# EasyEDA Pro project ProPrj_ProDoc_Board_AI8051U_20240829A_2024-08-30.epro, schematic Schematic_20240829A, sheet 6 of 6

## Sheets
6 P6
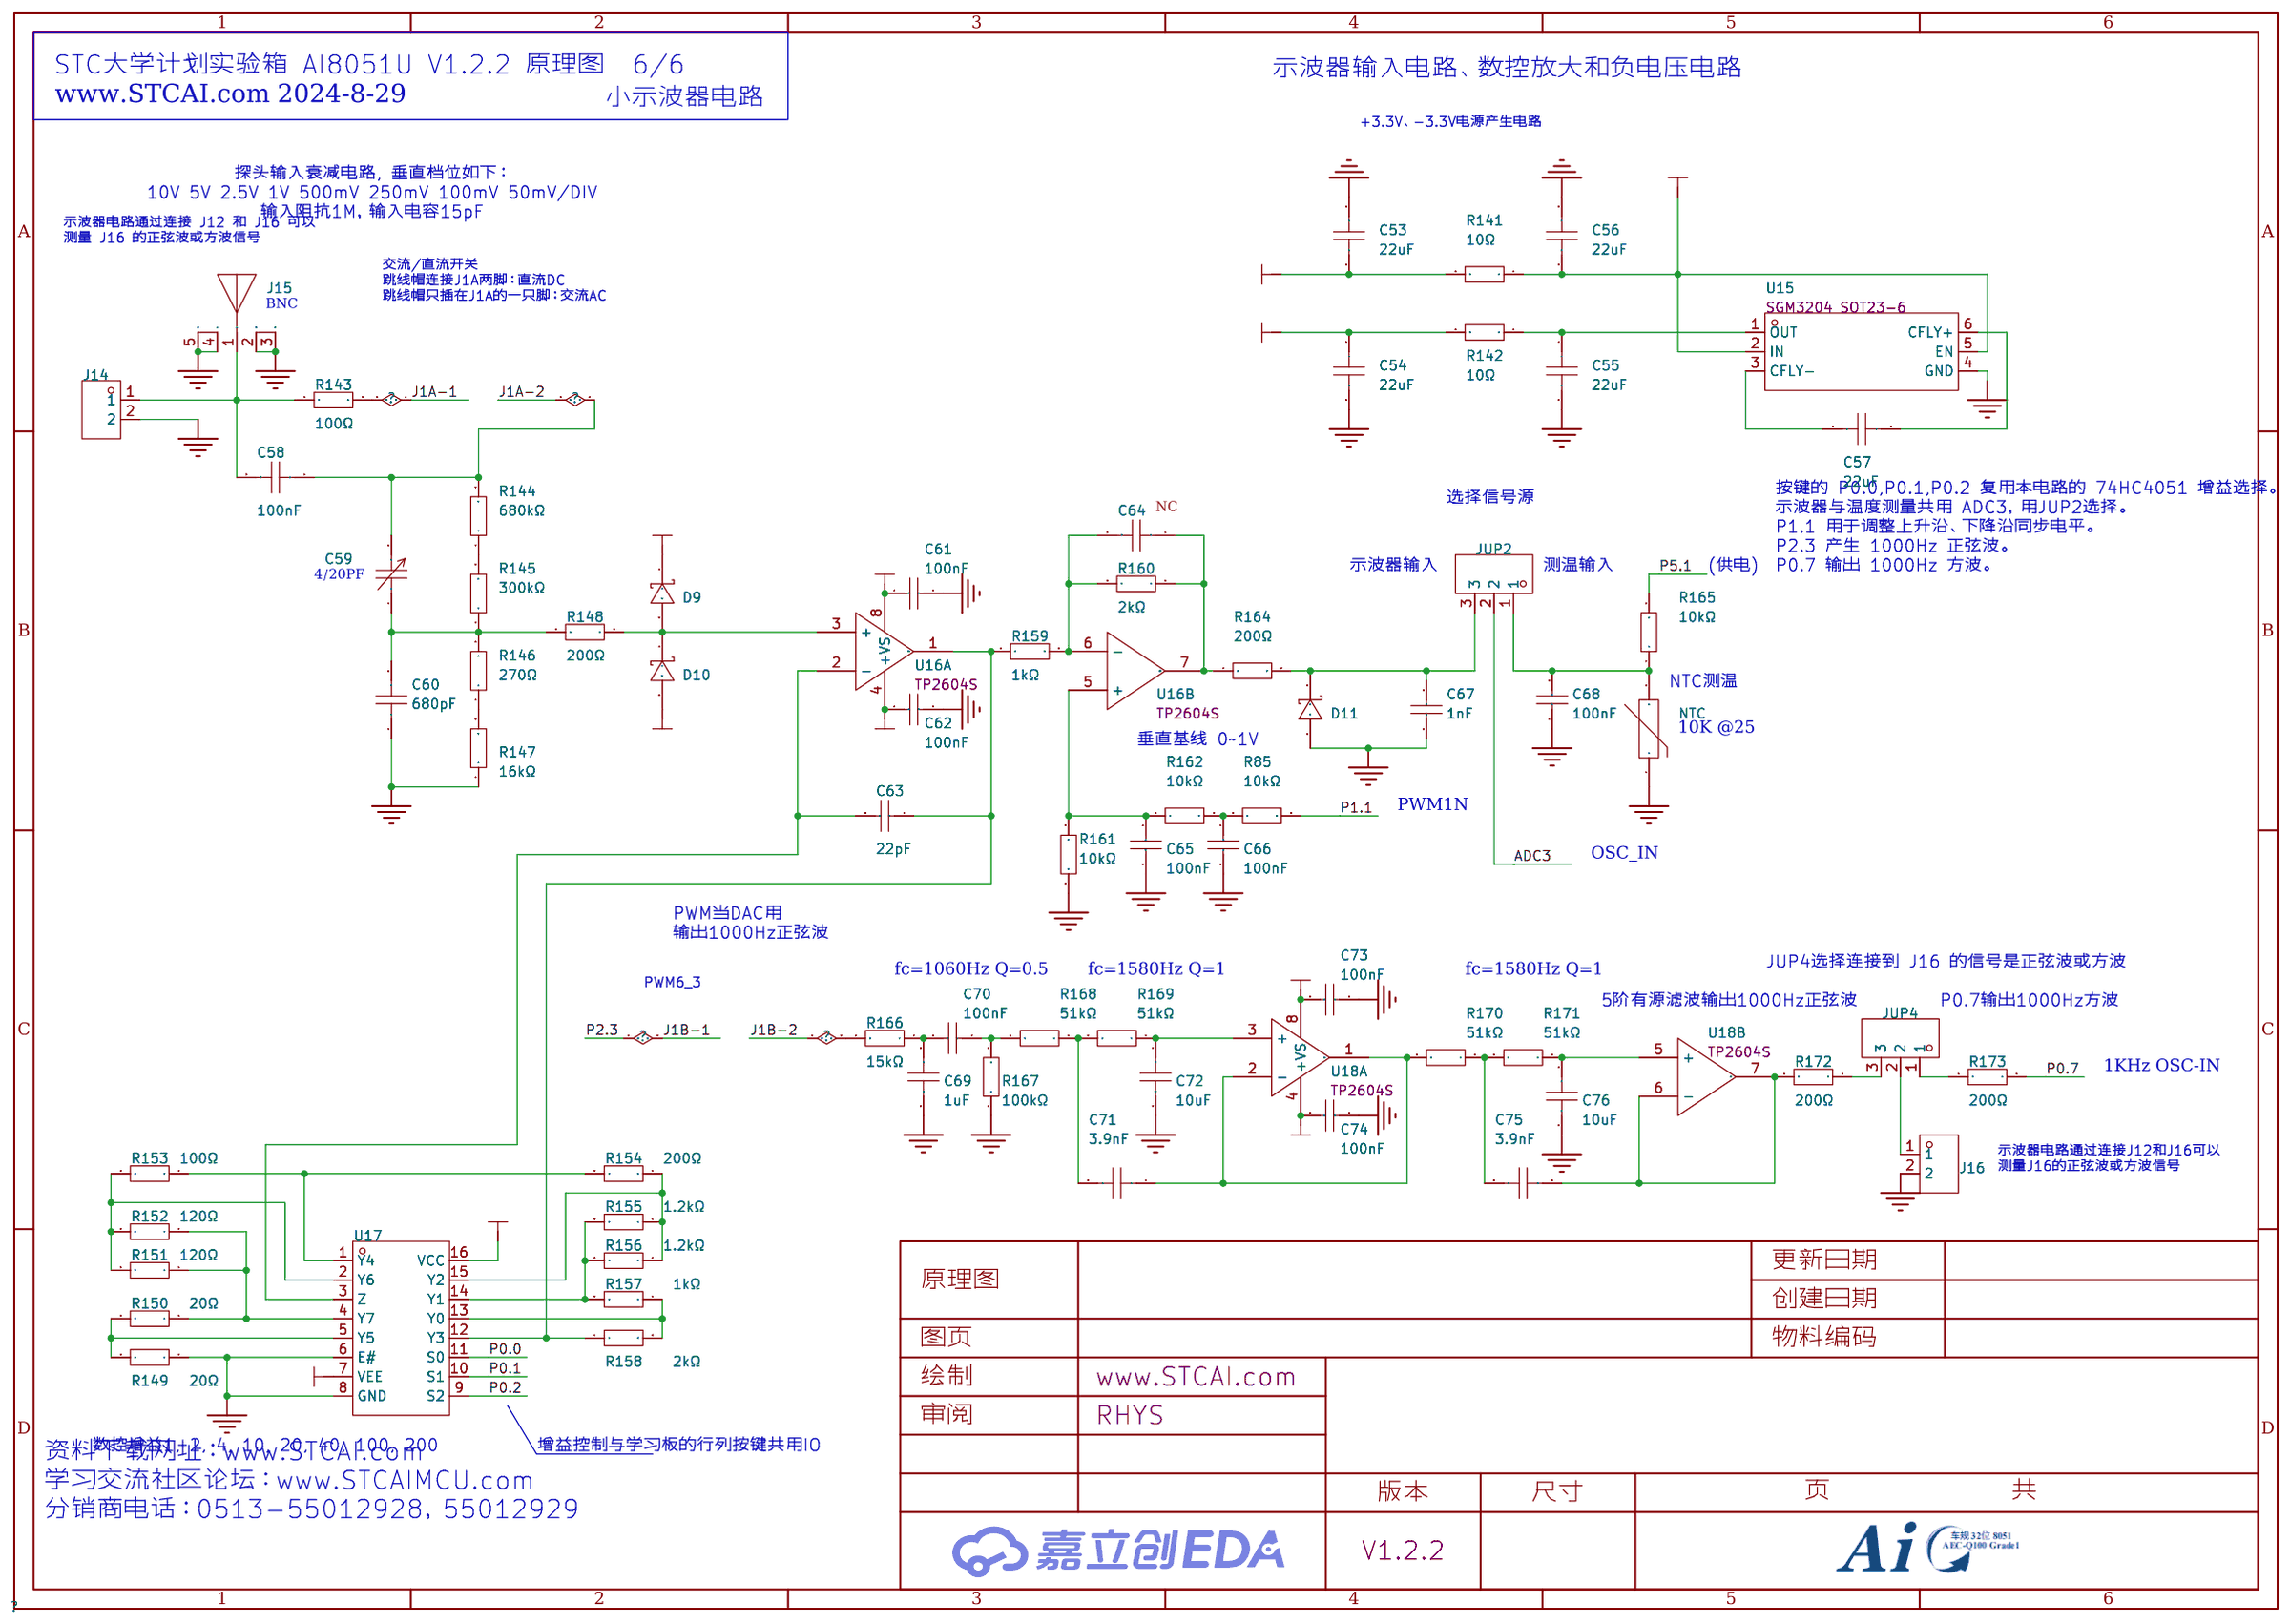
[diagram p5: P6]

## Parts
C53  22uF  [C0603]
C54  22uF  [C0603]
C55  22uF  [C0603]
C56  22uF  [C0603]
C57  22uF  [C0603]
C58  100nF  [C1206]
C59  GKG10015  [CAP-TH_GKGXXX15]
C60  680pF  [C0603]
C61  100nF  [C0603]
C62  100nF  [C0603]
C63  22pF  [C0603]
C64  100nF  [C0603]
C65  100nF  [C0603]
C66  100nF  [C0603]
C67  1nF  [C0603]
C68  100nF  [C0603]
C69  1uF  [C0603]
C70  100nF  [C0603]
C71  3.9nF  [C0603]
C72  10uF  [C0603]
C73  100nF  [C0603]
C74  100nF  [C0603]
C75  3.9nF  [C0603]
C76  10uF  [C0603]
D9  1N5817WS  [SOD-323_L1.8-W1.3-LS2.5-RD]
D10  1N5817WS  [SOD-323_L1.8-W1.3-LS2.5-RD]
D11  1N5817WS  [SOD-323_L1.8-W1.3-LS2.5-RD]
J14  BX-XH2.54-2PZZ  [CONN-TH_2P-P2.50_BX-XH2.54-2PZZ]
J15  DOSIN-801-0078  [ANT-TH_DOSIN-801-0078]
J16  BX-XH2.54-2PZZ  [CONN-TH_2P-P2.50_BX-XH2.54-2PZZ]
JUP2  DZ254S-11-03-48  [HDR-TH_3P-P2.54_DZ254S-11-03-48]
JUP4  DZ254S-11-03-48  [HDR-TH_3P-P2.54_DZ254S-11-03-48]
NTC  SDNT1608X103F3950FTF  [R0603]
R85  10kΩ  [R0603]
R141  10Ω  [R0603]
R142  10Ω  [R0603]
R143  100Ω  [R0603]
R144  680kΩ  [R0603]
R145  300kΩ  [R0603]
R146  270Ω  [R0603]
R147  16kΩ  [R0603]
R148  200Ω  [R0603]
R149  20Ω  [R0603]
R150  20Ω  [R0603]
R151  120Ω  [R0603]
R152  120Ω  [R0603]
R153  100Ω  [R0603]
R154  200Ω  [R0603]
R155  1.2kΩ  [R0603]
R156  1.2kΩ  [R0603]
R157  1kΩ  [R0603]
R158  2kΩ  [R0603]
R159  1kΩ  [R0603]
R160  2kΩ  [R0603]
R161  10kΩ  [R0603]
R162  10kΩ  [R0603]
R164  200Ω  [R0603]
R165  10kΩ  [R0603]
R166  15kΩ  [R0603]
R167  100kΩ  [R0603]
R168  51kΩ  [R0603]
R169  51kΩ  [R0603]
R170  51kΩ  [R0603]
R171  51kΩ  [R0603]
R172  200Ω  [R0603]
R173  200Ω  [R0603]
U15  SGM3204 SOT23-6  [SOT-23-6_L2.9-W1.6-P0.95-LS2.8-BR]
U16  TP2604S  [SOIC-8_L4.9-W3.9-P1.27-LS6.0-BL]  (sections 1,2)
U17  74HC4051  [SOP-16_L9.9-W3.9-P1.27-LS6.0-BL]
U18  TP2604S  [SOIC-8_L4.9-W3.9-P1.27-LS6.0-BL]  (sections 1,2)

## Library data of the parts
C53-C57 = CL10A226MO7JZNC: 容值:22uF;精度:±20%;额定电压:16V;材质(温度系数):X5R;; LCSC Part Name: 22uF ±20% 16V; Supplier Part: C2762594; Manufacturer: SAMSUNG(三星); Supplier Footprint: 0603; JLCPCB Part Class: 扩展库; Datasheet: https://atta.szlcsc.com/upload/public/pdf/source/20220811/0832C3B1C642040B023B7A6186895861.pdf; Supplier: LCSC; Tolerance: ±20%; Voltage Rated: 16V; Temperature Coefficient: X5R
C58 = 1206B104K251NT_C2909525: 容值:100nF;精度:±10%;额定电压:250V;材质(温度系数):X7R;; LCSC Part Name: 100nF ±10% 250V; Supplier Part: C2909525; Manufacturer: FH(风华); Manufacturer Part: 1206B104K251NT; Supplier Footprint: 1206; JLCPCB Part Class: 扩展库; Datasheet: https://atta.szlcsc.com/upload/public/pdf/source/20211026/1B9CC6FF40D574A190437DF0D5F8F6A6.pdf; Supplier: LCSC; Tolerance: ±10%; Voltage Rated: 250V; Temperature Coefficient: X7R
C59 = GKG10015: 静电容量:3pF~10pF;Q值:300@1MHz;; LCSC Part Name: 3pF~10pF; Supplier Part: C7281543; Manufacturer: EW Electronics; Supplier Footprint: 插件; JLCPCB Part Class: 扩展库; Datasheet: https://atta.szlcsc.com/upload/public/pdf/source/231023/GKGxx015_016_Series_DS-90a4209247c940cb70af2bed7fe9267d.pdf; Supplier: LCSC; electrostatic capacity: 3pF~10pF; Q @ Freq: 300@1MHz; Operating Temperature: -25℃~+85℃; Body Height: 5mm
C60 = CL10C681JB81PNC: 容值:680pF;精度:±5%;额定电压:50V;材质(温度系数):C0G;; LCSC Part Name: 680pF ±5% 50V; Supplier Part: C472800; Manufacturer: SAMSUNG(三星); Supplier Footprint: 0603; JLCPCB Part Class: 扩展库; Datasheet: https://atta.szlcsc.com/upload/public/pdf/source/20160218/1457707763339.pdf; Supplier: LCSC; Tolerance: ±5%; Voltage Rated: 50V; Temperature Coefficient: C0G
C61 C62 C65 C66 C68 C70 C73 C74 = CL10B104KO8NNNC: 容值:100nF;精度:±10%;额定电压:16V;材质(温度系数):X7R;; LCSC Part Name: 100nF ±10% 16V; Supplier Part: C66501; Manufacturer: SAMSUNG(三星); Supplier Footprint: 0603; JLCPCB Part Class: 扩展库; Datasheet: https://atta.szlcsc.com/upload/public/pdf/source/20160218/1457707763339.pdf; Supplier: LCSC; Tolerance: ±10%; Voltage Rated: 16V; Temperature Coefficient: X7R
C63 = CL10C220JB8NNNC: 容值:22pF;精度:±5%;额定电压:50V;材质(温度系数):C0G;; LCSC Part Name: 22pF ±5% 50V; Supplier Part: C1653; Manufacturer: SAMSUNG(三星); Supplier Footprint: 0603; Datasheet: https://atta.szlcsc.com/upload/public/pdf/source/20160218/1457707763339.pdf; Supplier: LCSC; Tolerance: ±5%; Voltage Rated: 50V; Temperature Coefficient: C0G
C64 = CC0603KRX7R9BB104: 容值:100nF;精度:±10%;额定电压:50V;材质(温度系数):X7R;; LCSC Part Name: 100nF ±10% 50V; Supplier Part: C14663; Manufacturer: YAGEO(国巨); Supplier Footprint: 0603; JLCPCB Part Class: 基础库; Datasheet: https://atta.szlcsc.com/upload/public/pdf/source/20180910/C282072_33301C7F631E79921B82A8DAC6BCC5B3.pdf; Supplier: LCSC; Tolerance: ±10%; Voltage Rated: 50V; Temperature Coefficient: X7R
C67 = CL10B102KB8NNNC: 容值:1nF;精度:±10%;额定电压:50V;材质(温度系数):X7R;; LCSC Part Name: 1nF ±10% 50V; Supplier Part: C1588; Manufacturer: SAMSUNG(三星); Supplier Footprint: 0603; JLCPCB Part Class: 基础库; Datasheet: https://atta.szlcsc.com/upload/public/pdf/source/20160218/1457707763339.pdf; Supplier: LCSC; Tolerance: ±10%; Voltage Rated: 50V; Temperature Coefficient: X7R
C69 = CL10A105KB8NNNC: 容值:1uF;精度:±10%;额定电压:50V;材质(温度系数):X5R;; LCSC Part Name: 1uF ±10% 50V; Supplier Part: C15849; Manufacturer: SAMSUNG(三星); Supplier Footprint: 0603; Datasheet: https://atta.szlcsc.com/upload/public/pdf/source/20160218/1457707763339.pdf; Supplier: LCSC; Tolerance: ±10%; Voltage Rated: 50V; Temperature Coefficient: X5R
C71 C75 = TCC0603X7R392K500CT: 容值:3.9nF;精度:±10%;额定电压:50V;材质(温度系数):X7R;; LCSC Part Name: 3.9nF ±10% 50V; Supplier Part: C376832; Manufacturer: CCTC(三环); Supplier Footprint: 0603; JLCPCB Part Class: 扩展库; Datasheet: https://atta.szlcsc.com/upload/public/pdf/source/20191203/C466239_F62A586702D44EEA1C39B32FC8662B21.pdf; Supplier: LCSC; Tolerance: ±10%; Voltage Rated: 50V; Temperature Coefficient: X7R
C72 C76 = CL10A106KP8NNNC: 容值:10uF;精度:±10%;额定电压:10V;材质(温度系数):X5R;; LCSC Part Name: 10uF ±10% 10V; Supplier Part: C19702; Manufacturer: SAMSUNG(三星); Supplier Footprint: 0603; Datasheet: https://atta.szlcsc.com/upload/public/pdf/source/20160218/1457707763339.pdf; Supplier: LCSC; Tolerance: ±10%; Voltage Rated: 10V; Temperature Coefficient: X5R
D9-D11 = 1N5817WS: 正向压降(Vf):750mV@3.1A;直流反向耐压(Vr):20V;平均整流电流(Io):1A;; LCSC Part Name: 电压:20V 电流:1A; Supplier Part: C489146; Manufacturer: KEXIN(科信); Supplier Footprint: SOD-323; JLCPCB Part Class: 扩展库; Datasheet: https://atta.szlcsc.com/upload/public/pdf/source/20200225/C489147_F0861A42A5EB259406EDAA7C68BCB597.pdf; Supplier: LCSC; Forward Voltage (Vf@If): 750mV@3.1A; Reverse Voltage (Vr): 20V; Average Rectified Current (Io): 1A
J14 J16 = BX-XH2.54-2PZZ: 插针结构:1x2P;间距:2.54mm;安装方式:直插;参考系列:XH;总PIN数:2P;排数:1;每排PIN数:2;行距:-;额定电流:3A;触头材质:黄铜;触头镀层:锡;工作温度范围:-25℃~+85℃;; Supplier Part: C18077833; Manufacturer: Bossie(博锡); Supplier Footprint: 插件,P=2.54mm; Datasheet: https://atta.szlcsc.com/upload/public/pdf/source/20231017/CB25E46A13930659CD6CDE2F2553A508.pdf; Supplier: LCSC; Pins Structure: 1x2P; Pitch: 2.54mm; Mounting Style: 直插; Reference Series: XH; Number of Pins: 2P; Number of Rows: 1; Number of PINs Per Row: 2; Current Rating (Max): 3A; Contact Material: 黄铜; Contact Plating: 锡; Operating Temperature Range: -25℃~+85℃
J15 = DOSIN-801-0078_C709676: 连接器类型:板端;接口类型:-;端口数量:1;接口直径:9.6mm;接口长度/高度:-;频率-最大值:3GHz;射频系列:BNC;阻抗:50Ω;样式:弯头;工作温度范围:-65℃~+165℃;; LCSC Part Name: BNC 弯头 三件套; Supplier Part: C709676; Manufacturer: dosinconn(德索五金); Supplier Footprint: 插件; JLCPCB Part Class: 扩展库; Datasheet: https://atta.szlcsc.com/upload/public/pdf/source/20200723/C709676_0A7EBCBF50F68B99E2BE199A434018D0.pdf; Supplier: LCSC; Connector Type: 板端; Number of Ports: 1; Interface Diameter: 9.6mm; Frequency-Max: 3GHz; RF Series: BNC; Impedance: 50Ω; Style: 弯头; Operating Temperature Range: -65℃~+165℃
JUP2 JUP4 = DZ254S-11-03-48: 插针结构:1x3P;间距:2.54mm;圆针/方针:方针;安装类型:立贴;排数:单排;总PIN位数:3P;; LCSC Part Name: 间距:2.54mm 1x3P 立贴 方针; Supplier Part: C5160786; Manufacturer: DEALON(德艺隆); Supplier Footprint: SMD,P=2.54mm(交错脚); JLCPCB Part Class: 扩展库; Datasheet: https://atta.szlcsc.com/upload/public/pdf/source/20230921/FE4E6D7F32A2CD9B95B1709A1ADE25FC.pdf; Supplier: LCSC; Pin Structure: 1x3P; Pitch: 2.54mm; Circluar Pins/Square Pins: 方针; Mounting Type: 立贴; Number of Rows: 单排; Number of Pins: 3P
NTC = SDNT1608X103F3950FTF: 阻值(25℃):10kΩ;B值(25℃/50℃):3950K;电阻精度:±1%;功率:100mW;B值精度:±1%;最大稳态电流(25℃):330uA;; LCSC Part Name: 10kΩ 电阻精度:±1% 3950K; Supplier Part: C279936; Manufacturer: Sunlord(顺络); Supplier Footprint: 0603; JLCPCB Part Class: 扩展库; Datasheet: https://atta.szlcsc.com/upload/public/pdf/source/20210916/BF106A3565EDFEB141CB3E0EA3A661F8.pdf; Supplier: LCSC; Resistance @ 25℃: 10kΩ; B Constant (25℃/50℃): 3950K; Resistance Tolerance: ±1%; Power: 100mW; B Constant Tolerance: ±1%; Steady State Current (Max): 330uA; Operating Temperature: -55℃~+125℃
R85 R161 R162 = 0603WAF1002T5E: 电阻类型:厚膜电阻;阻值:10kΩ;精度:±1%;功率:100mW;最大工作电压:75V;温度系数:±100ppm/℃;; LCSC Part Name: 厚膜电阻 10kΩ ±1% 100mW; Supplier Part: C25804; Manufacturer: UNI-ROYAL(厚声); Supplier Footprint: 0603; JLCPCB Part Class: 基础库; Datasheet: https://atta.szlcsc.com/upload/public/pdf/source/20200306/C422600_1E6D84923E4A46A82E41ADD87F860B5C.pdf; Supplier: LCSC; Type: 厚膜电阻; Tolerance: ±1%; Power(Watts): 100mW; Overload Voltage (Max): 75V; Temperature Coefficient: ±100ppm/℃; Operating Temperature Range: -55℃~+155℃
R141 R142 = 0603WAF100JT5E: 电阻类型:厚膜电阻;阻值:10Ω;精度:±1%;功率:100mW;最大工作电压:75V;温度系数:±400ppm/℃;; LCSC Part Name: 10Ω ±1% 100mW 厚膜电阻; Supplier Part: C22859; Manufacturer: UNI-ROYAL(厚声); Supplier Footprint: 0603; Datasheet: https://atta.szlcsc.com/upload/public/pdf/source/20200306/C422600_1E6D84923E4A46A82E41ADD87F860B5C.pdf; Supplier: LCSC; Type: 厚膜电阻; Tolerance: ±1%; Power(Watts): 100mW; Overload Voltage (Max): 75V; Temperature Coefficient: ±400ppm/℃; Operating Temperature Range: -55℃~+155℃
R143 R153 = 0603WAF1000T5E: 电阻类型:厚膜电阻;阻值:100Ω;精度:±1%;功率:100mW;最大工作电压:75V;温度系数:±200ppm/℃;; LCSC Part Name: 100Ω ±1% 100mW 厚膜电阻; Supplier Part: C22775; Manufacturer: UNI-ROYAL(厚声); Supplier Footprint: 0603; JLCPCB Part Class: 基础库; Datasheet: https://atta.szlcsc.com/upload/public/pdf/source/20200306/C422600_1E6D84923E4A46A82E41ADD87F860B5C.pdf; Supplier: LCSC; Type: 厚膜电阻; Tolerance: ±1%; Power(Watts): 100mW; Overload Voltage (Max): 75V; Temperature Coefficient: ±200ppm/℃; Operating Temperature Range: -55℃~+155℃
R144 = RC0603JR-07680KL: 电阻类型:厚膜电阻;阻值:680kΩ;精度:±5%;功率:100mW;最大工作电压:75V;温度系数:±100ppm/℃;; LCSC Part Name: 厚膜电阻 680kΩ ±5% 100mW; Supplier Part: C141272; Manufacturer: YAGEO(国巨); Supplier Footprint: 0603; JLCPCB Part Class: 扩展库; Datasheet: https://atta.szlcsc.com/upload/public/pdf/source/20180821/C275644_0D56F95EFF785E7D9A1FEF436B37DA78.pdf; Supplier: LCSC; Type: 厚膜电阻; Tolerance: ±5%; Power(Watts): 100mW; Overload Voltage (Max): 75V; Temperature Coefficient: ±100ppm/℃; Operating Temperature Range: -55℃~+155℃
R145 = 0603WAF3003T5E: 电阻类型:厚膜电阻;阻值:300kΩ;精度:±1%;功率:100mW;最大工作电压:75V;温度系数:±100ppm/℃;; LCSC Part Name: 300kΩ ±1% 100mW 厚膜电阻; Supplier Part: C23024; Manufacturer: UNI-ROYAL(厚声); Supplier Footprint: 0603; Datasheet: https://atta.szlcsc.com/upload/public/pdf/source/20200306/C422600_1E6D84923E4A46A82E41ADD87F860B5C.pdf; Supplier: LCSC; Type: 厚膜电阻; Tolerance: ±1%; Power(Watts): 100mW; Overload Voltage (Max): 75V; Temperature Coefficient: ±100ppm/℃; Operating Temperature Range: -55℃~+155℃
R146 = 0603WAF2700T5E: 电阻类型:厚膜电阻;阻值:270Ω;精度:±1%;功率:100mW;最大工作电压:75V;温度系数:±100ppm/℃;; LCSC Part Name: 270Ω ±1% 100mW 厚膜电阻; Supplier Part: C22966; Manufacturer: UNI-ROYAL(厚声); Supplier Footprint: 0603; Datasheet: https://atta.szlcsc.com/upload/public/pdf/source/20200306/C422600_1E6D84923E4A46A82E41ADD87F860B5C.pdf; Supplier: LCSC; Type: 厚膜电阻; Tolerance: ±1%; Power(Watts): 100mW; Overload Voltage (Max): 75V; Temperature Coefficient: ±100ppm/℃; Operating Temperature Range: -55℃~+155℃
R147 = AC0603FR-0716KL: 电阻类型:厚膜电阻;阻值:16kΩ;精度:±1%;功率:100mW;最大工作电压:75V;温度系数:±100ppm/℃;; LCSC Part Name: 厚膜电阻 16kΩ ±1% 100mW; Supplier Part: C144696; Manufacturer: YAGEO(国巨); Supplier Footprint: 0603; JLCPCB Part Class: 扩展库; Datasheet: https://atta.szlcsc.com/upload/public/pdf/source/20180927/C229861_4ABDC471507C1ED6AFB4BA66AFC8620A.pdf; Supplier: LCSC; Type: 厚膜电阻; Tolerance: ±1%; Power(Watts): 100mW; Overload Voltage (Max): 75V; Temperature Coefficient: ±100ppm/℃; Operating Temperature Range: -55℃~+155℃
R148 R154 R164 R172 R173 = 0603WAF2000T5E: 电阻类型:厚膜电阻;阻值:200Ω;精度:±1%;功率:100mW;最大工作电压:75V;温度系数:±100ppm/℃;; LCSC Part Name: 200Ω ±1% 100mW 厚膜电阻; Supplier Part: C8218; Manufacturer: UNI-ROYAL(厚声); Supplier Footprint: 0603; JLCPCB Part Class: 基础库; Datasheet: https://atta.szlcsc.com/upload/public/pdf/source/20200306/C422600_1E6D84923E4A46A82E41ADD87F860B5C.pdf; Supplier: LCSC; Type: 厚膜电阻; Tolerance: ±1%; Power(Watts): 100mW; Overload Voltage (Max): 75V; Temperature Coefficient: ±100ppm/℃; Operating Temperature Range: -55℃~+155℃
R149 R150 = 0603WAF200JT5E: 电阻类型:厚膜电阻;阻值:20Ω;精度:±1%;功率:100mW;最大工作电压:75V;温度系数:±100ppm/℃;; LCSC Part Name: 20Ω ±1% 100mW 厚膜电阻; Supplier Part: C22950; Manufacturer: UNI-ROYAL(厚声); Supplier Footprint: 0603; Datasheet: https://atta.szlcsc.com/upload/public/pdf/source/20200306/C422600_1E6D84923E4A46A82E41ADD87F860B5C.pdf; Supplier: LCSC; Type: 厚膜电阻; Tolerance: ±1%; Power(Watts): 100mW; Overload Voltage (Max): 75V; Temperature Coefficient: ±100ppm/℃; Operating Temperature Range: -55℃~+155℃
R151 R152 = 0603WAF1200T5E: 电阻类型:厚膜电阻;阻值:120Ω;精度:±1%;功率:100mW;最大工作电压:75V;温度系数:±100ppm/℃;; LCSC Part Name: 120Ω ±1% 100mW 厚膜电阻; Supplier Part: C22787; Manufacturer: UNI-ROYAL(厚声); Supplier Footprint: 0603; Datasheet: https://atta.szlcsc.com/upload/public/pdf/source/20200306/C422600_1E6D84923E4A46A82E41ADD87F860B5C.pdf; Supplier: LCSC; Type: 厚膜电阻; Tolerance: ±1%; Power(Watts): 100mW; Overload Voltage (Max): 75V; Temperature Coefficient: ±100ppm/℃; Operating Temperature Range: -55℃~+155℃
R155 R156 = 0603WAF1201T5E: 电阻类型:厚膜电阻;阻值:1.2kΩ;精度:±1%;功率:100mW;最大工作电压:75V;温度系数:±100ppm/℃;; LCSC Part Name: 1.2kΩ ±1% 100mW 厚膜电阻; Supplier Part: C22765; Manufacturer: UNI-ROYAL(厚声); Supplier Footprint: 0603; Datasheet: https://atta.szlcsc.com/upload/public/pdf/source/20200306/C422600_1E6D84923E4A46A82E41ADD87F860B5C.pdf; Supplier: LCSC; Type: 厚膜电阻; Tolerance: ±1%; Power(Watts): 100mW; Overload Voltage (Max): 75V; Temperature Coefficient: ±100ppm/℃; Operating Temperature Range: -55℃~+155℃
R157 R159 = 0603WAF1001T5E: 电阻类型:厚膜电阻;阻值:1kΩ;精度:±1%;功率:100mW;最大工作电压:75V;温度系数:±100ppm/℃;; LCSC Part Name: 1kΩ ±1% 100mW 厚膜电阻; Supplier Part: C21190; Manufacturer: UNI-ROYAL(厚声); Supplier Footprint: 0603; JLCPCB Part Class: 基础库; Datasheet: https://atta.szlcsc.com/upload/public/pdf/source/20200306/C422600_1E6D84923E4A46A82E41ADD87F860B5C.pdf; Supplier: LCSC; Type: 厚膜电阻; Tolerance: ±1%; Power(Watts): 100mW; Overload Voltage (Max): 75V; Temperature Coefficient: ±100ppm/℃; Operating Temperature Range: -55℃~+155℃
R158 R160 = 0603WAF2001T5E: 电阻类型:厚膜电阻;阻值:2kΩ;精度:±1%;功率:100mW;最大工作电压:75V;温度系数:±100ppm/℃;; LCSC Part Name: 2kΩ ±1% 100mW 厚膜电阻; Supplier Part: C22975; Manufacturer: UNI-ROYAL(厚声); Supplier Footprint: 0603; JLCPCB Part Class: 基础库; Datasheet: https://atta.szlcsc.com/upload/public/pdf/source/20200306/C422600_1E6D84923E4A46A82E41ADD87F860B5C.pdf; Supplier: LCSC; Type: 厚膜电阻; Tolerance: ±1%; Power(Watts): 100mW; Overload Voltage (Max): 75V; Temperature Coefficient: ±100ppm/℃; Operating Temperature Range: -55℃~+155℃
R165 = ARG03BTC1002: 电阻类型:薄膜电阻;阻值:10kΩ;精度:±0.1%;功率:100mW;最大工作电压:75V;温度系数:±25ppm/℃;; LCSC Part Name: 薄膜电阻 10kΩ ±0.1% 100mW; Supplier Part: C309083; Manufacturer: Viking(光颉); Supplier Footprint: 0603; JLCPCB Part Class: 扩展库; Datasheet: https://atta.szlcsc.com/upload/public/pdf/source/20190816/C412422_E173BA386C6DD8245B6A88358EF9877A.pdf; Supplier: LCSC; Type: 薄膜电阻; Tolerance: ±0.1%; Power(Watts): 100mW; Overload Voltage (Max): 75V; Temperature Coefficient: ±25ppm/℃; Operating Temperature Range: -55℃~+155℃
R166 = 0603WAF1502T5E: 电阻类型:厚膜电阻;阻值:15kΩ;精度:±1%;功率:100mW;最大工作电压:75V;温度系数:±100ppm/℃;; LCSC Part Name: 15kΩ ±1% 100mW 厚膜电阻; Supplier Part: C22809; Manufacturer: UNI-ROYAL(厚声); Supplier Footprint: 0603; JLCPCB Part Class: 基础库; Datasheet: https://atta.szlcsc.com/upload/public/pdf/source/20200306/C422600_1E6D84923E4A46A82E41ADD87F860B5C.pdf; Supplier: LCSC; Type: 厚膜电阻; Tolerance: ±1%; Power(Watts): 100mW; Overload Voltage (Max): 75V; Temperature Coefficient: ±100ppm/℃; Operating Temperature Range: -55℃~+155℃
R167 = 0603WAF1003T5E: 电阻类型:厚膜电阻;阻值:100kΩ;精度:±1%;功率:100mW;最大工作电压:75V;温度系数:±100ppm/℃;; LCSC Part Name: 100kΩ ±1% 100mW 厚膜电阻; Supplier Part: C25803; Manufacturer: UNI-ROYAL(厚声); Supplier Footprint: 0603; JLCPCB Part Class: 基础库; Datasheet: https://atta.szlcsc.com/upload/public/pdf/source/20200306/C422600_1E6D84923E4A46A82E41ADD87F860B5C.pdf; Supplier: LCSC; Type: 厚膜电阻; Tolerance: ±1%; Power(Watts): 100mW; Overload Voltage (Max): 75V; Temperature Coefficient: ±100ppm/℃; Operating Temperature Range: -55℃~+155℃
R168-R171 = 0603WAF5102T5E: 电阻类型:厚膜电阻;阻值:51kΩ;精度:±1%;功率:100mW;最大工作电压:75V;温度系数:±100ppm/℃;; LCSC Part Name: 51kΩ ±1% 100mW 厚膜电阻; Supplier Part: C23196; Manufacturer: UNI-ROYAL(厚声); Supplier Footprint: 0603; JLCPCB Part Class: 基础库; Datasheet: https://atta.szlcsc.com/upload/public/pdf/source/20200306/C422600_1E6D84923E4A46A82E41ADD87F860B5C.pdf; Supplier: LCSC; Type: 厚膜电阻; Tolerance: ±1%; Power(Watts): 100mW; Overload Voltage (Max): 75V; Temperature Coefficient: ±100ppm/℃; Operating Temperature Range: -55℃~+155℃
U15 = SGM3204YN6G/TR: 功能类型:-;输入电压:1.4V~5.5V;输出电压:-5.5V~-1.4V;输出电流(最大值):200mA;; Supplier Part: C194031; Manufacturer: SGMICRO(圣邦微); Supplier Footprint: SOT-23-6; JLCPCB Part Class: 扩展库; Datasheet: https://atta.szlcsc.com/upload/public/pdf/source/20180627/C194031_755051E53122D645C36CF727711B963E.pdf; Supplier: LCSC; Input Voltage: 1.4V~5.5V; Output Voltage: -5.5V~-1.4V; Output Current (Max): 200mA; Switching Frequency: 950kHz; Number of Outputs: 1; Switch tube (built-in/external): 内置
U16 U18 = TP2604-SR: 运放类型:General Purpose;放大器组数:2;增益带宽积（GBP）:10MHz;压摆率（SR）:6.5 V/us;电源电压:2.7V ~ 36V, ±1.35V ~ 18V;各通道供电电流:1.2mA;; Supplier Part: C126446; Manufacturer: 3PEAK; Supplier Footprint: SOIC-8-150mil; Datasheet: https://atta.szlcsc.com/upload/public/pdf/source/20170821/C126446_1503303332965901583.pdf; Supplier: LCSC; Amplifier Type: General Purpose; Number of Circuits: 2; Gain Bandwidth Product（GBP）: 10MHz; Slew Rate（SR）: 6.5 V/us; Supply Voltage（Single）: 2.7V ~ 36V, ±1.35V ~ 18V; Iq per channel (Typ): 1.2mA; Operating Temperature: -40°C ~ 125°C
U17 = 74HC4051: 74HC4051 高速 CMOS 8 通道模拟多路复用器和多路信号分离器，八选一模拟开关（SP8T），适用于模拟或数字 8:1 多路选择开关; LCSC Part Name: 8路模拟,多路复用器/解复用器; Supplier Part: C2943297; Manufacturer: I-CORE(中微爱芯); Supplier Footprint: SOP-16; JLCPCB Part Class: 扩展库; Datasheet: https://atta.szlcsc.com/upload/public/pdf/source/20220510/C32FF90C2449EAD226E57ADFBC7ACACB.pdf; Supplier: LCSC

## Nets
+V3.3: C53.1 C61.2 C73.2 D9.1 R141.2 U16.8(+VS) U17.16(VCC) U18.8(+VS)
-V3.3: C54.1 C62.2 C74.2 D10.2 R142.2 U16.4(-VS) U17.7(VEE) U18.4(-VS)
GND: C53.2 C54.2 C55.2 C56.2 C60.1 C61.1 C62.1 C65.2 C66.2 C67.2 C68.2 C69.1 C72.2 C73.1 C74.1 C76.2 D11.2 J14.2 J15.2 J15.3 J15.4 J15.5 J16.2 NTC.1 R147.1 R149.1 R161.1 R167.2 U15.4(GND) U17.6(E#) U17.8(GND) ; also on sheet 1 2 3 4 5
ADC3: JUP2.2 ; also on sheet 1
J1A-1: R143.2 ; also on sheet 3
J1A-2: C58.1 C59.2 R144.2 ; also on sheet 3
J1B-2: R166.2 ; also on sheet 3
P0.0: U17.11(S0) ; also on sheet 1 3
P0.1: U17.10(S1) ; also on sheet 1 3
P0.2: U17.9(S2) ; also on sheet 1 3
P0.7: R173.2 ; also on sheet 1 3
P1.1: R85.2 ; also on sheet 1 4
P5.1: R165.2 ; also on sheet 1 5
SYS-VCC: C56.1 R141.1 U15.2(IN) U15.5(EN) ; also on sheet 2 3 4 5
$6N3551: C68.1 JUP2.1 NTC.2 R165.1
$6N3554: C67.1 D11.1 JUP2.3 R164.2
$6N3558: C65.1 R161.2 R162.1 U16.5(+)
$6N3559: C64.1 R160.1 R164.1 U16.7(OUTB)
$6N3560: C64.2 R159.2 R160.2 U16.6(-)
$6N3561: C55.1 R142.1 U15.1(OUT)
$6N3562: C57.1 U15.3(CFLY-)
$6N3578: C57.2 U15.6(CFLY+)
$6N3583: C69.2 C70.2 R166.1
$6N3584: C70.1 R167.1 R168.2
$6N3587: R157.1 R158.2 U17.13(Y0)
$6N3591: R154.1 R155.1 R156.1 U17.15(Y2)
$6N3592: R155.2 R156.2 R157.2 U17.14(Y1)
$6N3593: C71.2 R168.1 R169.2
$6N3594: C72.1 R169.1 U18.3(+)
$6N3596: C71.1 R170.2 U18.1(OUTA) U18.2(-)
$6N3609: R151.2 R152.2 R153.2 U17.2(Y6)
$6N3610: R153.1 R154.2 U17.1(Y4)
$6N3611: R150.1 R151.1 R152.1 U17.4(Y7)
$6N3614: R149.2 R150.2 U17.5(Y5)
$6N3615: C58.2 J14.1 J15.1 R143.1
$6N3623: C59.1 C60.2 R145.1 R146.2 R148.1
$6N3626: D9.2 D10.1 R148.2 U16.3(+)
$6N3628: JUP4.1 R173.1
$6N3629: J16.1 JUP4.2
$6N3631: JUP4.3 R172.2
$6N3679: C63.2 U16.2(-) U17.3(Z)
$6N3691: C63.1 R158.1 R159.1 U16.1(OUTA) U17.12(Y3)
$6N5298: C75.2 R170.1 R171.2
$6N5377: C76.1 R171.1 U18.5(+)
$6N5400: C75.1 R172.1 U18.6(-) U18.7(OUTB)
$6N5920: R144.1 R145.2
$6N6146: R146.1 R147.2
$6N6980: C66.1 R85.1 R162.2

## Notes on the sheets
sheet 6
- STC大学计划实验箱 AI8051U V1.2.2 原理图  6/6
- 示波器输入电路、数控放大和负电压电路
- www.STCAI.com
- 2024-8-29
- 小示波器电路
- +3.3V、-3.3V电源产生电路
- 探头输入衰减电路, 垂直档位如下：
  10V 5V 2.5V 1V 500mV 250mV 100mV 50mV/DIV
  输入阻抗1M，输入电容15pF
- 示波器电路通过连接 J12 和 J16 可以
  测量 J16 的正弦波或方波信号
- BNC
- 交流/直流开关
  跳线帽连接J1A两脚：直流DC
  跳线帽只插在J1A的一只脚：交流AC
- NC
- 选择信号源
- 4/20PF
- 示波器输入
- 测温输入
- (供电)
- 按键的 P0.0,P0.1,P0.2 复用本电路的 74HC4051 增益选择。
  示波器与温度测量共用 ADC3，用JUP2选择。
  P1.1 用于调整上升沿、下降沿同步电平。
  P2.3 产生 1000Hz 正弦波。
  P0.7 输出 1000Hz 方波。
- NTC测温
- 垂直基线 0~1V
- 10K @25
- PWM1N
- OSC_IN
- PWM当DAC用
  输出1000Hz正弦波
- fc=1060Hz Q=0.5
- fc=1580Hz Q=1
- fc=1580Hz Q=1
- JUP4选择连接到 J16 的信号是正弦波或方波
- PWM6_3
- 5阶有源滤波输出1000Hz正弦波
- P0.7输出1000Hz方波
- 1KHz OSC-IN
- 示波器电路通过连接J12和J16可以
  测量J16的正弦波或方波信号
- 数控增益1, 2, 4, 10, 20, 40, 100, 200
- 增益控制与学习板的行列按键共用IO
- 资料下载网址：www.STCAI.com
  学习交流社区论坛：www.STCAIMCU.com
  分销商电话：0513-55012928，55012929
